# Altium schematic sheet TOP_LEVEL.SchDoc
size B; DocumentNumber: 1; SheetNumber: 1; SheetTotal: 14; PAGE_TITLE: Top Level
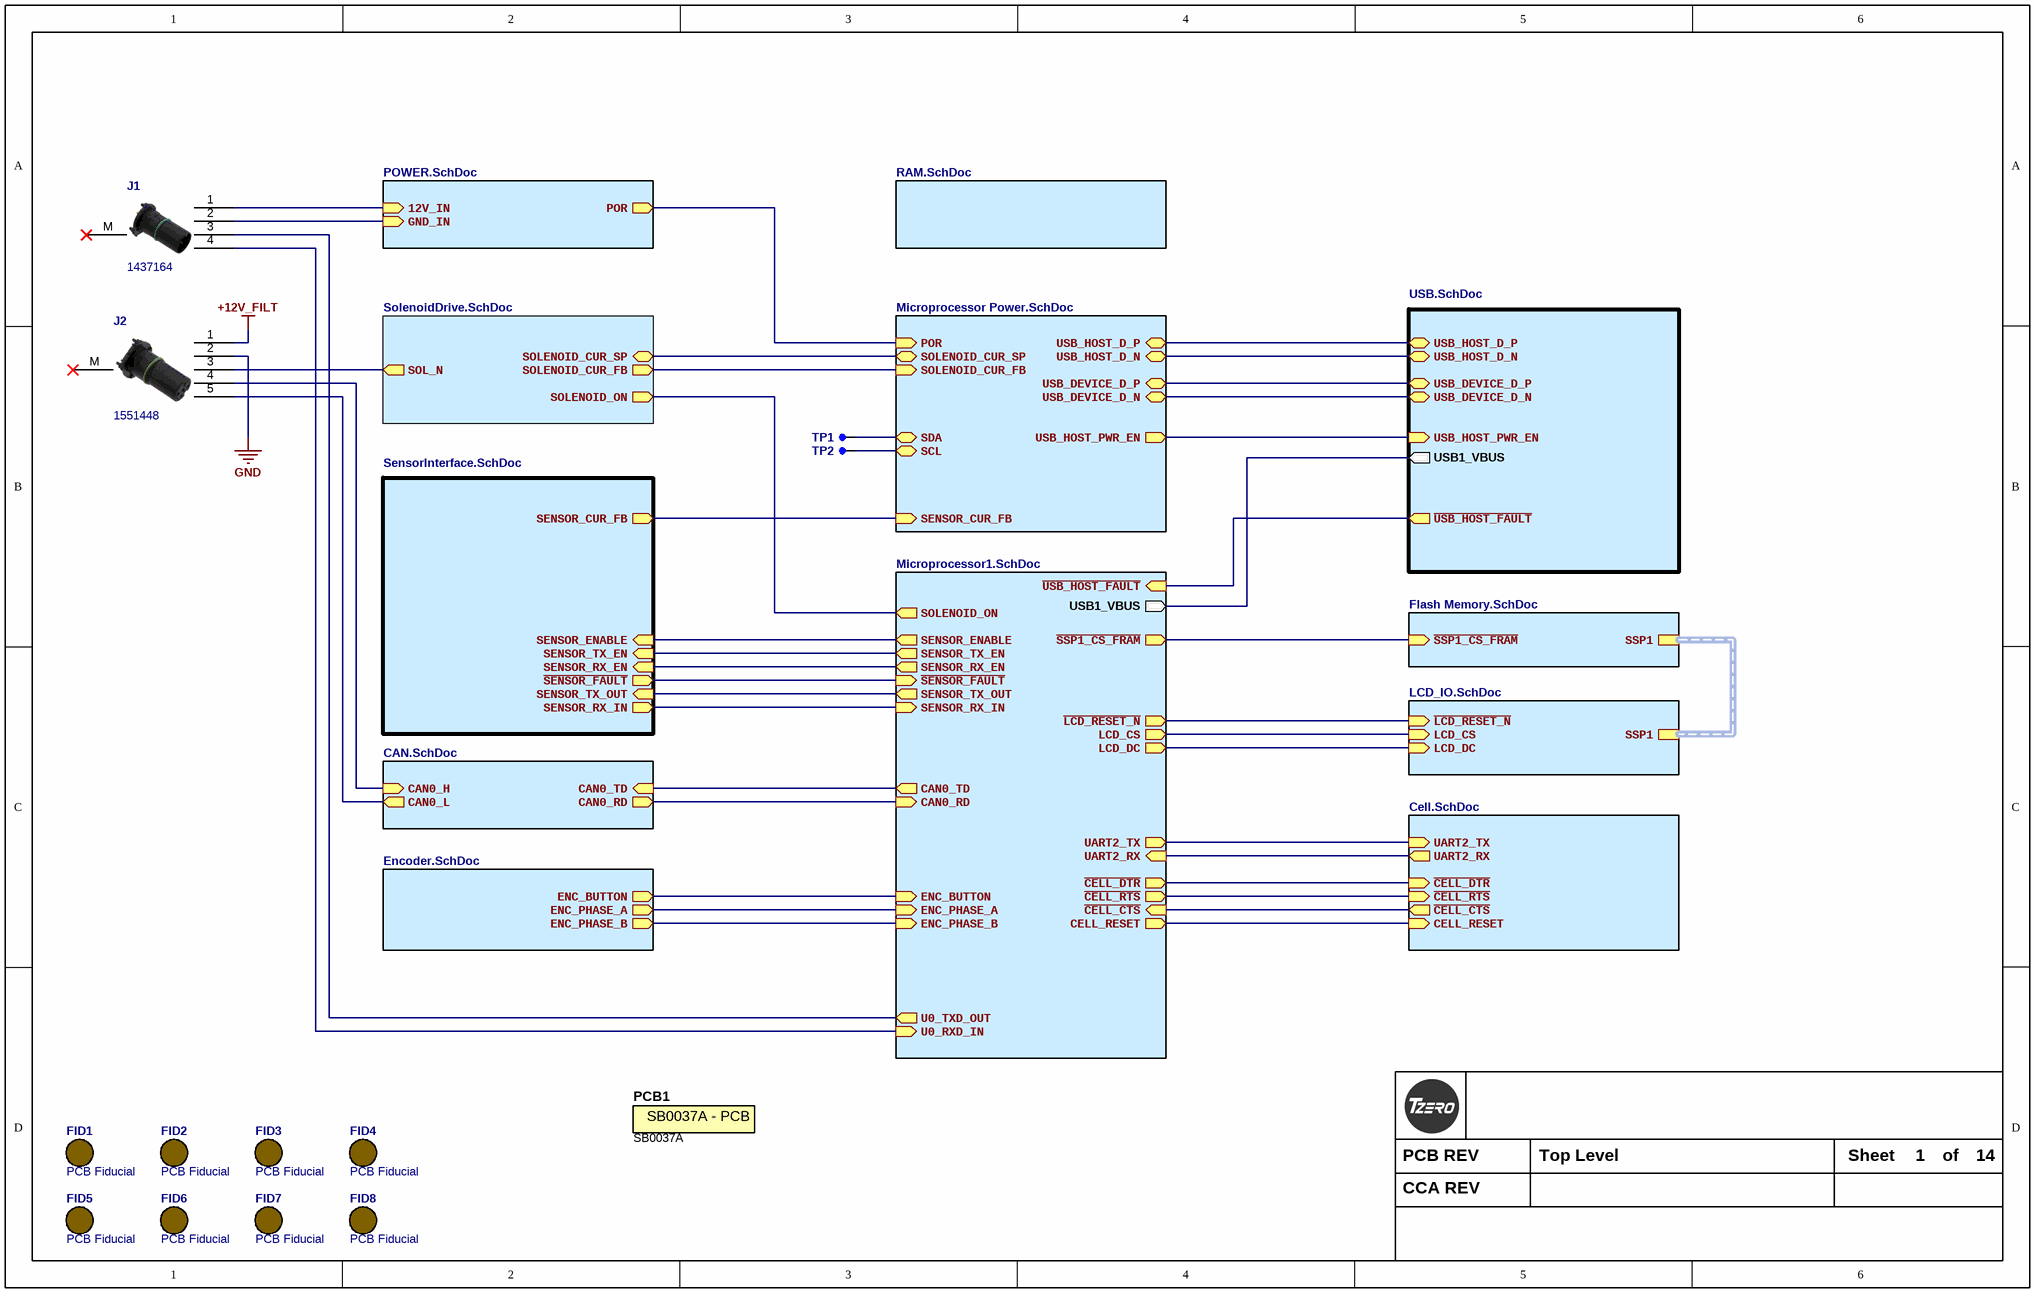
[diagram p0: TOP_LEVEL.SchDoc]

## Parts
FID1  PCB Fiducial  [Fiducial 1mm - 2mm]  (no BOM)
FID2  PCB Fiducial  [Fiducial 1mm - 2mm]  (no BOM)
FID3  PCB Fiducial  [Fiducial 1mm - 2mm]  (no BOM)
FID4  PCB Fiducial  [Fiducial 1mm - 2mm]  (no BOM)
FID5  PCB Fiducial  [Fiducial 1mm - 2mm]  (no BOM)
FID6  PCB Fiducial  [Fiducial 1mm - 2mm]  (no BOM)
FID7  PCB Fiducial  [Fiducial 1mm - 2mm]  (no BOM)
FID8  PCB Fiducial  [Fiducial 1mm - 2mm]  (no BOM)
J1  1437164  [1437164]
J2  1551448  [1551448]
PCB1  SB0037A  (mechanical)
TP1  (no value)  [TP_SMT_25_MIL_ROUND]  (net tie, no BOM)
TP2  (no value)  [TP_SMT_25_MIL_ROUND]  (net tie, no BOM)

## Sub-sheets
U_CAN = CAN.SchDoc: CAN0_RD (out), CAN0_TD (in), CAN0_L (out), CAN0_H (in)
U_Cell = Cell.SchDoc: UART2_TX (in), CELL_RESET (in), UART2_RX (out), ~{CELL_DTR} (in), ~{CELL_RTS} (in), ~{CELL_CTS} (out)
U_Encoder = Encoder.SchDoc: ENC_BUTTON (out), ENC_PHASE_A (out), ENC_PHASE_B (out)
U_Flash Memory = Flash Memory.SchDoc: ~{SSP1_CS_FRAM} (in), SSP1 (harness SSP1)
U_LCD_IO = LCD_IO.SchDoc: SSP1 (harness SSP1), ~{LCD_RESET_N} (in), LCD_CS (in), LCD_DC (in)
U_Microprocessor1 = Microprocessor1.SchDoc: LCD_DC (out), SENSOR_RX_EN (out), SOLENOID_ON (out), ~{SENSOR_FAULT} (in), SENSOR_ENABLE (out), SENSOR_TX_EN (out), SENSOR_TX_OUT (out), CAN0_TD (out), UART2_TX (out), SENSOR_RX_IN (in), ~{LCD_RESET_N} (out), UART2_RX (in), LCD_CS (out), ~{SSP1_CS_FRAM} (out), CAN0_RD (in), ENC_PHASE_B (in), ENC_PHASE_A (in), ENC_BUTTON (in), CELL_RESET (out), ~{CELL_DTR} (out), ~{CELL_RTS} (out), ~{CELL_CTS} (in), ~{USB_HOST_FAULT} (in), U0_RXD_IN (in), U0_TXD_OUT (out), USB1_VBUS (out)
U_Microprocessor Power = Microprocessor Power.SchDoc: SOLENOID_CUR_SP (bidir), SOLENOID_CUR_FB (in), USB_HOST_PWR_EN (out), SCL (bidir), SDA (bidir), POR (in), USB_DEVICE_D_P (bidir), USB_HOST_D_P (bidir), USB_DEVICE_D_N (bidir), USB_HOST_D_N (bidir), SENSOR_CUR_FB (in)
U_POWER = POWER.SchDoc: POR (out), 12V_IN (in), GND_IN (in)
U_RAM = RAM.SchDoc: no entries
U_SensorInterface = SensorInterface.SchDoc: SENSOR_TX_EN (in), SENSOR_ENABLE (in), ~{SENSOR_FAULT} (out), SENSOR_RX_IN (out), SENSOR_TX_OUT (in), SENSOR_RX_EN (in), SENSOR_CUR_FB (out)
U_SolenoidDrive = SolenoidDrive.SchDoc: SOLENOID_ON (out), SOLENOID_CUR_FB (out), SOLENOID_CUR_SP (bidir), SOL_N (out)
U_USB = USB.SchDoc: USB_HOST_D_P (bidir), USB_HOST_D_N (bidir), ~{USB_HOST_FAULT} (out), USB_HOST_PWR_EN (in), USB_DEVICE_D_P (bidir), USB_DEVICE_D_N (bidir), USB1_VBUS (out)

## Nets
+12V_FILT: J2.1
GND: J2.2
NetJ1_1: J1.1 ; sheet U_POWER/12V_IN
NetJ1_2: J1.2 ; sheet U_POWER/GND_IN
NetJ1_3: J1.3 ; sheet U_Microprocessor1/U0_TXD_OUT
NetJ1_4: J1.4 ; sheet U_Microprocessor1/U0_RXD_IN
NetJ2_3: J2.3 ; sheet U_SolenoidDrive/SOL_N
NetJ2_4: J2.4 ; sheet U_CAN/CAN0_H
NetJ2_5: J2.5 ; sheet U_CAN/CAN0_L
NetTP1_1: TP1.1 ; sheet U_Microprocessor Power/SDA
NetTP2_1: TP2.1 ; sheet U_Microprocessor Power/SCL
(unnamed): sheet U_SolenoidDrive/SOLENOID_ON, sheet U_Microprocessor1/SOLENOID_ON
(unnamed): sheet U_SolenoidDrive/SOLENOID_CUR_FB, sheet U_Microprocessor Power/SOLENOID_CUR_FB
(unnamed): sheet U_SolenoidDrive/SOLENOID_CUR_SP, sheet U_Microprocessor Power/SOLENOID_CUR_SP
(unnamed): sheet U_Cell/UART2_TX, sheet U_Microprocessor1/UART2_TX
(unnamed): sheet U_Cell/CELL_RESET, sheet U_Microprocessor1/CELL_RESET
(unnamed): sheet U_Cell/UART2_RX, sheet U_Microprocessor1/UART2_RX
(unnamed): sheet U_Cell/~{CELL_DTR}, sheet U_Microprocessor1/~{CELL_DTR}
(unnamed): sheet U_Cell/~{CELL_RTS}, sheet U_Microprocessor1/~{CELL_RTS}
(unnamed): sheet U_Cell/~{CELL_CTS}, sheet U_Microprocessor1/~{CELL_CTS}
(unnamed): sheet U_LCD_IO/~{LCD_RESET_N}, sheet U_Microprocessor1/~{LCD_RESET_N}
(unnamed): sheet U_LCD_IO/LCD_CS, sheet U_Microprocessor1/LCD_CS
(unnamed): sheet U_LCD_IO/LCD_DC, sheet U_Microprocessor1/LCD_DC
(unnamed): sheet U_SensorInterface/SENSOR_TX_EN, sheet U_Microprocessor1/SENSOR_TX_EN
(unnamed): sheet U_SensorInterface/SENSOR_ENABLE, sheet U_Microprocessor1/SENSOR_ENABLE
(unnamed): sheet U_SensorInterface/~{SENSOR_FAULT}, sheet U_Microprocessor1/~{SENSOR_FAULT}
(unnamed): sheet U_SensorInterface/SENSOR_RX_IN, sheet U_Microprocessor1/SENSOR_RX_IN
(unnamed): sheet U_SensorInterface/SENSOR_TX_OUT, sheet U_Microprocessor1/SENSOR_TX_OUT
(unnamed): sheet U_SensorInterface/SENSOR_RX_EN, sheet U_Microprocessor1/SENSOR_RX_EN
(unnamed): sheet U_SensorInterface/SENSOR_CUR_FB, sheet U_Microprocessor Power/SENSOR_CUR_FB
(unnamed): sheet U_Encoder/ENC_BUTTON, sheet U_Microprocessor1/ENC_BUTTON
(unnamed): sheet U_Encoder/ENC_PHASE_A, sheet U_Microprocessor1/ENC_PHASE_A
(unnamed): sheet U_Encoder/ENC_PHASE_B, sheet U_Microprocessor1/ENC_PHASE_B
(unnamed): sheet U_POWER/POR, sheet U_Microprocessor Power/POR
(unnamed): sheet U_CAN/CAN0_RD, sheet U_Microprocessor1/CAN0_RD
(unnamed): sheet U_CAN/CAN0_TD, sheet U_Microprocessor1/CAN0_TD
(unnamed): sheet U_Microprocessor1/~{SSP1_CS_FRAM}, sheet U_Flash Memory/~{SSP1_CS_FRAM}
(unnamed): sheet U_Microprocessor1/~{USB_HOST_FAULT}, sheet U_USB/~{USB_HOST_FAULT}
(unnamed): sheet U_Microprocessor1/USB1_VBUS, sheet U_USB/USB1_VBUS
(unnamed): sheet U_Microprocessor Power/USB_HOST_PWR_EN, sheet U_USB/USB_HOST_PWR_EN
(unnamed): sheet U_Microprocessor Power/USB_DEVICE_D_P, sheet U_USB/USB_DEVICE_D_P
(unnamed): sheet U_Microprocessor Power/USB_HOST_D_P, sheet U_USB/USB_HOST_D_P
(unnamed): sheet U_Microprocessor Power/USB_DEVICE_D_N, sheet U_USB/USB_DEVICE_D_N
(unnamed): sheet U_Microprocessor Power/USB_HOST_D_N, sheet U_USB/USB_HOST_D_N

Not connected (* = marked no-connect by the designer): J1 M*; J2 M*

## Buses and harness runs
harness sheet U_Flash Memory/SSP1 = sheet U_LCD_IO/SSP1

## Notes on the sheet
- PCB REV
- Sheet
- of
- CCA REV
- (in symbol SB0037A) SB0037A - PCB

## Library data of the parts
FID1-FID8 = Fiducial: Value: PCB Fiducial
J1 = 1437164: Circular Metric Connectors SACC-CI-M12MS- 4CON-L180 THR; Manufacturer: Phoenix Contact; Current Rating: 4A; Voltage Rating: 250V; Number of Contacts: 4; Connector Type: Plug; Gender: Female; Strain Relief: No (Without); Number of Ports: 1; Thread Size: M12; Ratings: IP67,Waterproof,Dust Tight; Value: 1437164; Supplier 1: Digi-Key; Manufacturer Part Number: 1437164; Stock 1: 71; Pricing 1: 1=6.15000, 10=5.88500, 50=5.72500, 100=5.35040, 250=4.92240, 500=4.54784, 1000=4.33387, 2500=3.87875 (USD); RoHS: Yes; Mount: Through Hole; Contact Material: Brass; Contact Plating: Gold; Housing Material: Polyamide; Number of Terminals: 4; Min Operating Temperature: -25°C; Max Operating Temperature: 85°C; Packaging: Tray; Max Current Rating: 4A; Termination: Solder; Package Quantity: 60; Contact Gender: Male; Number of Positions: 4; Orientation: Straight; Fastening Type: Threaded; ComponentLink1URL: https://datasheet.ciiva.com/16136/1437164-16136065.pdf?src-supplier=Onlinecomponents.com; ComponentLink1Description: https://datasheet.ciiva.com/16136/1437164-16136065.pdf?src-supplier=Onlinecomponents.com; ComponentLink2URL: https://datasheet.ciiva.com/29256/586130-da-01-en-sens-akt-einbaust-4pol-1437164-60-st-29256645.pdf?src-supplier=Conrad; ComponentLink2Description: https://datasheet.ciiva.com/29256/586130-da-01-en-sens-akt-einbaust-4pol-1437164-60-st-29256645.pdf?src-supplier=Conrad; Supplier Part Number 1: 277-13184-ND
J2 = 1551448: Flush-type connector SACC-CI-M12FS-5CON-L180-THR 1551448 Phoenix Contact; Plating: Polyamide; Number of Positions: 5; Current Rating: 4A; Voltage Rating: 60V; Connector Type: Receptacle; Number of Ports: 1; Thread Size: M12; Ratings: IP67,Waterproof,Dust Tight; Value: 1551448; Supplier 1: Digi-Key; Supplier Part Number 1: 277-13414-ND; Manufacturer: Phoenix Contact; Manufacturer Part Number: 1551448; Stock: 70; Pricing: 1=8.12, 10=7.771, 50=7.5588, 100=7.0642, 250=6.4991, 500=6.0046, 1000=5.722, 2500=5.3688 (USD); RoHS: Yes; Mount: Through Hole; Weight: 0.123459oz; Contact Plating: Gold; Contact Material: Brass; Number of Terminals: 5; Min Operating Temperature: -25°C; Max Operating Temperature: 85°C; Packaging: Tray; Number of Contacts: 5; Contact Gender: Female; Termination: Solder; Package Quantity: 60; Fastening Type: Threaded; Orientation: Straight; Max Current Rating: 4A; Lead Free: Lead Free; ComponentLink1URL: https://datasheet.ciiva.com/618/1551448-618993.pdf?src-supplier=Digi-Key; ComponentLink1Description: https://datasheet.ciiva.com/618/1551448-618993.pdf?src-supplier=Digi-Key; ComponentLink2URL: https://datasheet.ciiva.com/24433/1551448-24433704.pdf?src-supplier=Onlinecomponents.com; ComponentLink2Description: https://datasheet.ciiva.com/24433/1551448-24433704.pdf?src-supplier=Onlinecomponents.com; ComponentLink3URL: https://datasheet.ciiva.com/29259/719975-da-01-en-sens-akt-einbaubuch-5pol-1551448-60-st-29259372.pdf?src-supplier=Conrad; ComponentLink3Description: https://datasheet.ciiva.com/29259/719975-da-01-en-sens-akt-einbaubuch-5pol-1551448-60-st-29259372.pdf?src-supplier=Conrad
PCB1 = SB0037A: SB0037 Temp Controller Raw PCB Rev A; Manufacturer: TZero; Manufacturer Part Number: SB0024B; Value: SB0037A
TP1 TP2 = TP SMT 25MIL: Sort Value: *; Category: *; CategorySort: *